# Altium schematic sheet GPS.SchDoc
size A4; SheetNumber: 4; SheetTotal: 5
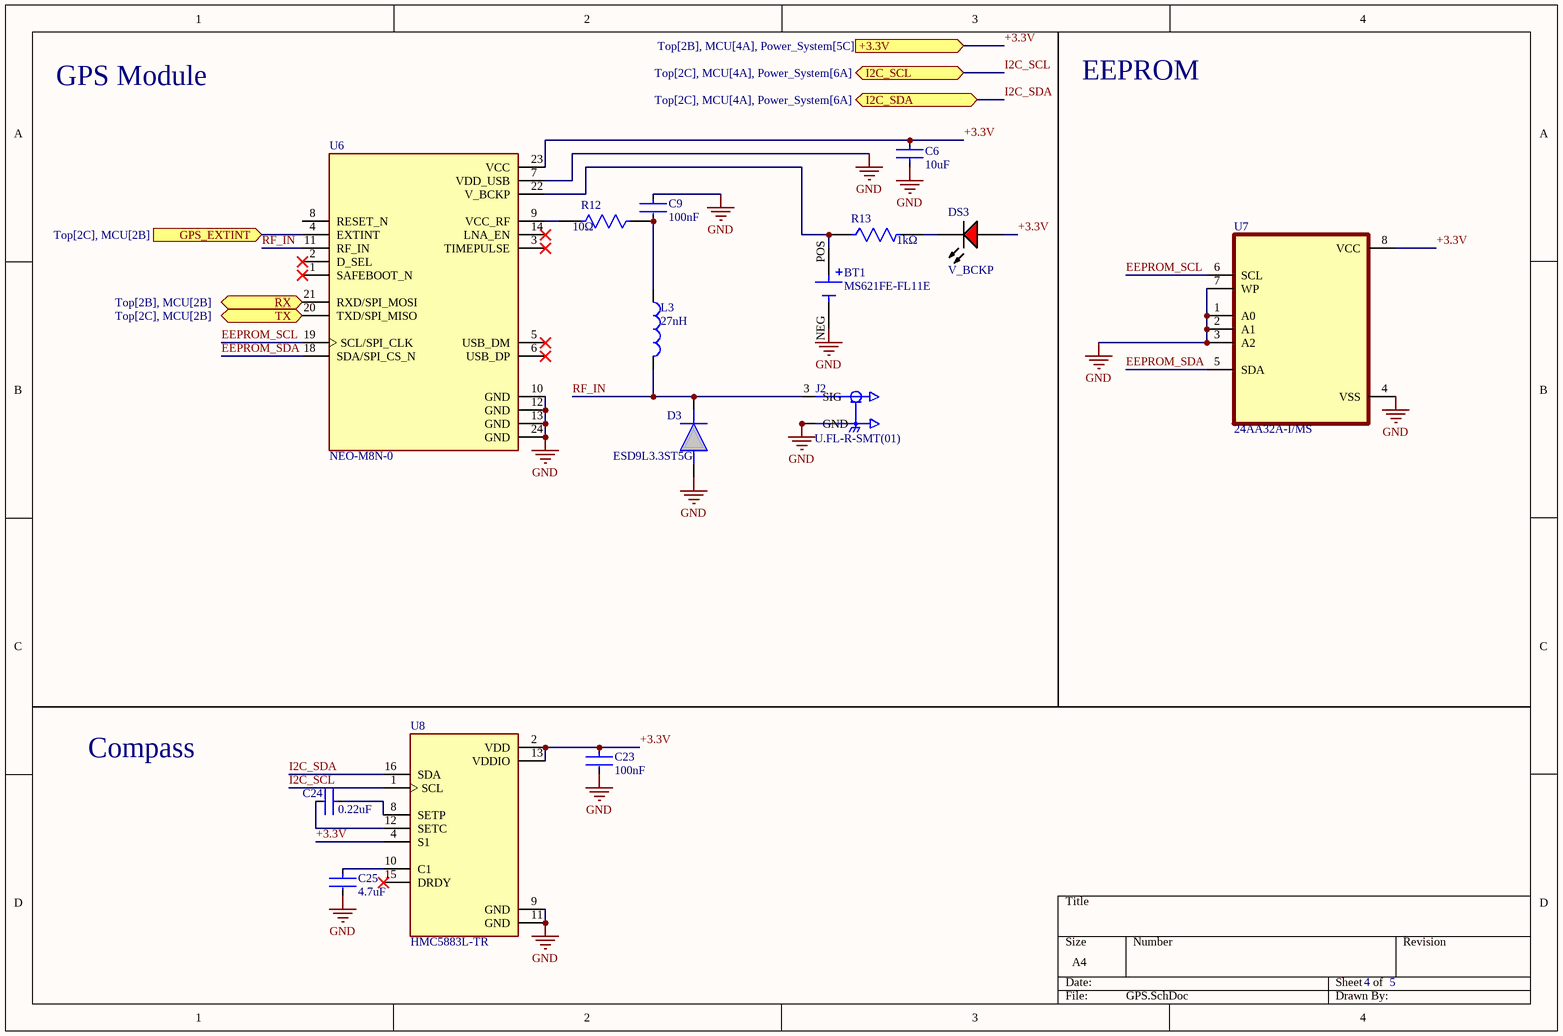
[diagram p0: GPS.SchDoc]

## Parts
BT1  MS621FE-FL11E  [BAT_MS621FE-FL11E]
C6  10uF  [0603_CAPACITOR]
C9  100nF  [0603_CAPACITOR]
C23  100nF  [0402_CAPACITOR]
C24  0.22uF  [0402_CAPACITOR]
C25  4.7uF  [0402_CAPACITOR]
D3  ESD9L3.3ST5G  [DIOM1006X40N]
DS3  V_BCKP  [RED_LED_1206]
J2  U.FL-R-SMT(01)  [HRS_U.FL-R-SMT(01)]
L3  27nH  [27nH]
R12  value 10Ω  [1206_RESISTOR]
R13  value 1kΩ  [0603_RESISTOR]  (hidden comment: RESISTOR)
U6  NEO-M8N-0  [XCVR_NEO-M8N-0]
U7  24AA32A-I/MS  [SOP65P490X110-8N (memory)]
U8  HMC5883L-TR  [XDCR_HMC5883L-TR]

## Ports
+3.3V (in, see Top[2B], MCU[4A], Power_System[5C]), GPS_EXTINT (in, see Top[2C], MCU[2B]), I2C_SCL (bidir, see Top[2C], MCU[4A], Power_System[6A]), I2C_SDA (bidir, see Top[2C], MCU[4A], Power_System[6A]), RX (bidir, see Top[2B], MCU[2B]), TX (bidir, see Top[2C], MCU[2B])

## Nets
GND: BT1.NEG C6.1 C9.1 C23.2 C25.2 D3.2(A) J2.1(GND) J2.2(GND) U6.7(VDD_USB) U6.10(GND) U6.12(GND) U6.13(GND) U6.24(GND) U7.1(A0) U7.2(A1) U7.3(A2) U7.4(VSS) U7.7(WP) U8.9(GND) U8.11(GND)
+3.3V: C6.2 C23.1 DS3.1(A) U6.23(VCC) U7.8(VCC) U8.2(VDD) U8.4(S1) U8.13(VDDIO) ; port +3.3V
EEPROM_SCL: U6.19(SCL/SPI_CLK) U7.6(SCL)
EEPROM_SDA: U6.18(SDA/SPI_CS_N) U7.5(SDA)
GPS_EXTINT: U6.4(EXTINT) ; port GPS_EXTINT
I2C_SCL: U8.1(SCL) ; port I2C_SCL
I2C_SDA: U8.16(SDA) ; port I2C_SDA
RF_IN: D3.1(K) J2.3(SIG) L3.2 U6.11(RF_IN)
RX: U6.21(RXD/SPI_MOSI) ; port RX
TX: U6.20(TXD/SPI_MISO) ; port TX
NetBT1_POS: BT1.POS R13.1 U6.22(V_BCKP)
NetC9_2: C9.2 L3.1 R12.1
NetC24_1: C24.1 U8.8(SETP)
NetC24_2: C24.2 U8.12(SETC)
NetC25_1: C25.1 U8.10(C1)
NetDS3_2: DS3.2(K) R13.2
NetR12_2: R12.2 U6.9(VCC_RF)

Not connected (* = marked no-connect by the designer): U6 1(SAFEBOOT_N)* 2(D_SEL)* 3(TIMEPULSE)* 5(USB_DM)* 6(USB_DP)* 8(RESET_N) 14(LNA_EN)*; U8 15(DRDY)*

## Notes on the sheet
- GPS Module
- EEPROM
- Compass

## Library data of the parts
BT1 = MS621FE-FL11E: Coin, 6.8mm 3 V Lithium Battery Rechargeable (Secondary) 5.5mAh; MF: Seiko Instruments; Value: *; Purchase-URL: https://pricing.snapeda.com/search/part/MS621FE-FL11E/?ref=eda; Package: QFP-128 Seiko; Availability: In Stock; Check_prices: https://www.snapeda.com/parts/MS621FE-FL11E/Seiko+Instruments/view-part/?ref=eda; Price: None; SnapEDA_Link: https://www.snapeda.com/parts/MS621FE-FL11E/Seiko+Instruments/view-part/?ref=snap; MP: MS621FE-FL11E
C6 C9 C23-C25 = CMP-001-00091-1: Design Item ID: CAPACITOR; Source: gps_project_schematic_library.SchLib
D3 = ESD9L3.3ST5G: Transient Voltage Suppressors ESD Protection Diodes with UltraLow Capacitance; Manufacturer_Name: onsemi; Geometry.Height: 0.4mm; Manufacturer_Part_Number: ESD9L3.3ST5G; Mouser Part Number: 863-ESD9L3.3ST5G; Mouser Price/Stock: https://www.mouser.co.uk/ProductDetail/ON-Semiconductor/ESD9L33ST5G?qs=N5dOQkml4H9EihHTKPOUhA%3D%3D; Arrow Part Number: ESD9L3.3ST5G; Arrow Price/Stock: https://www.arrow.com/en/products/esd9l3.3st5g/on-semiconductor?region=nac; Datasheet Link: https://www.onsemi.com/pub/Collateral/ESD9L-D.PDF
DS3 = LED_RED_1206: LED Red, 65 mW, -40 to 85 degC, 2-Pin SMD, RoHS, Tape and Reel; Manufacturer: Lumex; Part No: SML-LX1206IC-TR; LED Material: GaAsP; Peak Wavelength: 635nm; Number of LEDs: 1; Viewing Angle: 160; Reverse Voltage: 5(Min)V; Lens Appearance: ColorlessNonDiffused; Intensity: 6mcd; Type: Uni-Color; Pin_Count: 2; Lens Dimensions: 2x1.6x0.5mm; Mounting: SurfaceMount; ECCN: EAR99; RoHS: Unknown; Package Description: 2-Pin Surface Mount Device, Body 3.2 x 1.5 mm; Mounting Technology: SurfaceMount; Dominant Wavelength: N/A; Supplier_Package: SMD; Supplier Standard Pack: 3,000; Color: Red; Dimension: 3.2x1.6x1.1mm; HTS: 8541402000; Family: SML-LX1206IC; Supplier: Lumex; Datasheet URL: http://www.lumex.com/content/files/ProductAttachment/SML-LX1206IC-TR.pdf; Package Reference: SML-LX1206IC; Manufacturer URL: http://www.lumexinstruments.com/; Operating Temperature: -25to85C; Packaging: TapeandReel; Datasheet Version: Rev. J, 08/2012
J2 = U.FL-R-SMT(01): U.FL (UMCC) Connector Receptacle, Male Pin 50Ohm Surface Mount Solder. RF Connectors / Coaxial Connectors; MF: Hirose; Check_prices: https://www.snapeda.com/parts/U.FL-R-SMT(01)/Hirose+Electric+Co+Ltd/view-part/?ref=eda; Value: *; Availability: In Stock; MP: U.FL-R-SMT(01); Price: None; Package: None; SnapEDA_Link: https://www.snapeda.com/parts/U.FL-R-SMT(01)/Hirose+Electric+Co+Ltd/view-part/?ref=snap; Purchase-URL: https://pricing.snapeda.com/search/part/U.FL-R-SMT(01)/?ref=eda
L3 = 27nH: Inductor with Inductance: 27nH Tol. +/-5%, Package: 0402 _1005_; MP: LQG15HS27NJ02D; MF: Murata; Price: None; Value: *; Package: 1005 Murata; SnapEDA_Link: https://www.snapeda.com/parts/LQG15HS27NJ02D/Murata%20Electronics%20North%20America/view-part/53478/?ref=snap; Availability: Unavailable
R12 = RESISTOR
U6 = NEO-M8N-0: series RF Receiver BeiDou, Galileo, GLONASS, GNSS, GPS 1.575GHz -167dBm - - -; MF: U-Blox America; SnapEDA_Link: https://www.snapeda.com/parts/NEO-M8N-0/u-blox/view-part/?ref=snap; Package: SMD-24 U-Blox America Inc.; Value: *; MP: NEO-M8N-0; Check_prices: https://www.snapeda.com/parts/NEO-M8N-0/u-blox/view-part/?ref=eda
U7 = 24AA32A-I/MS: 32K, 4K X 8 1.8V SERIAL EE IND | Microchip Technology Inc. 24AA32A-I/MS; SnapEDA_Link: https://www.snapeda.com/parts/24AA32A-I/MS/Microchip/view-part/?ref=snap; Package: MSOP-8 Microchip; Value: *; MF: Microchip; MP: 24AA32A-I/MS; Check_prices: https://www.snapeda.com/parts/24AA32A-I/MS/Microchip/view-part/?ref=eda
U8 = HMC5883L-TR: Board Mount Hall Effect / Magnetic Sensors Sensors, Transducers Magnetic - Hall Effect, Digital Switch, Linear, Compass (ICs) - IC COMPASS 3 AXIS I2C 16LCC SMD; MF: STMicroelectronics; MP: HMC5883LTR; SnapEDA_Link: https://www.snapeda.com/parts/HMC5883LTR/STMicroelectronics/view-part/?ref=snap; Package: LCC-16 STMicroelectronics; Value: *; Check_prices: https://www.snapeda.com/parts/HMC5883LTR/STMicroelectronics/view-part/?ref=eda